# Altium schematic sheet System.SchDoc
size A4; SheetNumber: 3; SheetTotal: 7
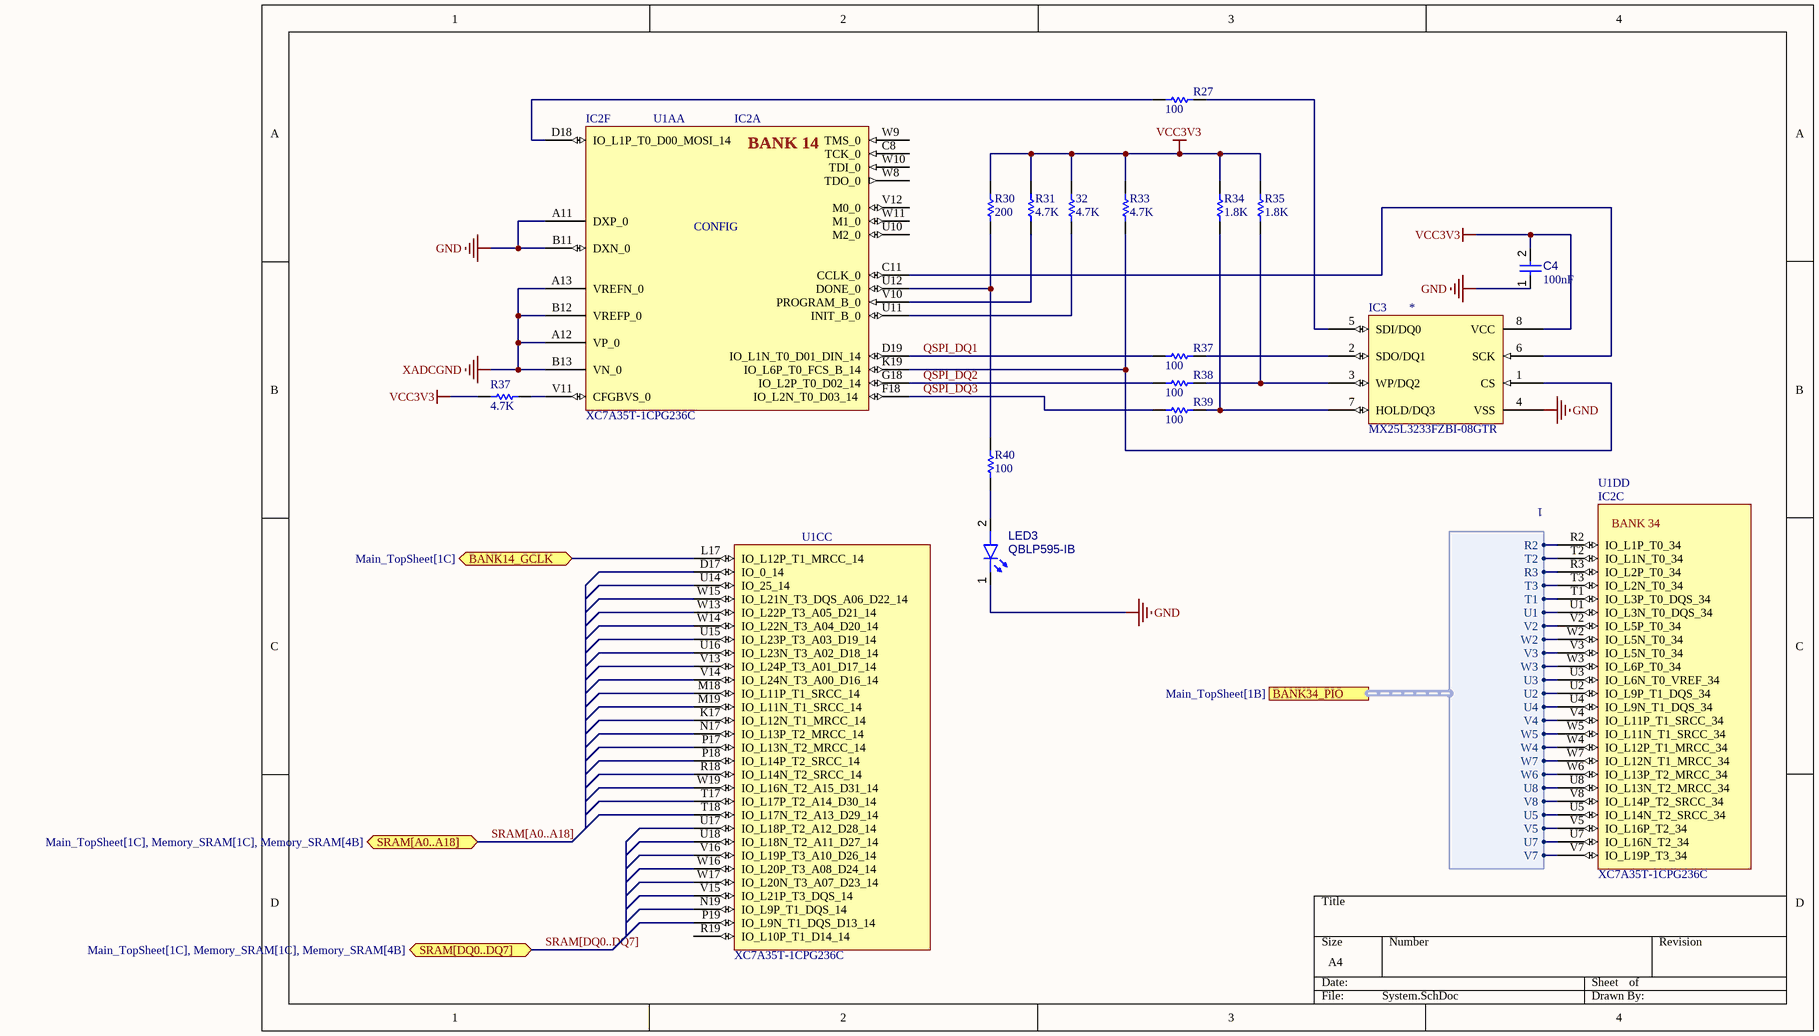
[diagram p0: System.SchDoc]

## Parts
(Parts that share a designator on the sheet are numbered #1, #2 ... from top to bottom, then left to right.)
32  value 4.7K  [RESC1005X40X25ML05T10]  (hidden comment: Resistor 51k +/-5% 0402 63 mW)
*  MX25L3233FZBI-08GTR  [SON127P500X80_HS-9N]
C4  value 100nF  [CAPC0402(1005)60_L]  (hidden comment: Capacitor 100nF +/-20% 10V 0402)
LED3  QBLP595-IB  [QTB-QBLP595_V]
R27  value 100  [RESC1005X40X25ML05T10]  (hidden comment: Resistor 51k +/-5% 0402 63 mW)
R30  value 200  [RESC1005X40X25ML05T10]  (hidden comment: Resistor 51k +/-5% 0402 63 mW)
R31  value 4.7K  [RESC1005X40X25ML05T10]  (hidden comment: Resistor 51k +/-5% 0402 63 mW)
R33  value 4.7K  [RESC1005X40X25ML05T10]  (hidden comment: Resistor 51k +/-5% 0402 63 mW)
R34  value 1.8K  [RESC1005X40X25ML05T10]  (hidden comment: Resistor 51k +/-5% 0402 63 mW)
R35  value 1.8K  [RESC1005X40X25ML05T10]  (hidden comment: Resistor 51k +/-5% 0402 63 mW)
R37#1  value 100  [RESC1005X40X25ML05T10]  (hidden comment: Resistor 51k +/-5% 0402 63 mW)
R37#2  value 4.7K  [RESC1005X40X25ML05T10]  (hidden comment: Resistor 51k +/-5% 0402 63 mW)
R38  value 100  [RESC1005X40X25ML05T10]  (hidden comment: Resistor 51k +/-5% 0402 63 mW)
R39  value 100  [RESC1005X40X25ML05T10]  (hidden comment: Resistor 51k +/-5% 0402 63 mW)
R40  value 100  [RESC1005X40X25ML05T10]  (hidden comment: Resistor 51k +/-5% 0402 63 mW)
U1A  XC7A35T-1CPG236C  [BGA81C50P19X19_1000X1000X110]  (part A of 3)
U1C  XC7A35T-1CPG236C  [BGA81C50P19X19_1000X1000X110]  (part C of 4)
U1D  XC7A35T-1CPG236C  [BGA81C50P19X19_1000X1000X110]  (part D of 4)

## Ports
BANK14_GCLK (bidir, see Main_TopSheet[1C]), BANK34_PIO (harness 1, see Main_TopSheet[1B]), SRAM[A0..A18] (bidir, see Main_TopSheet[1C], Memory_SRAM[1C], Memory_SRAM[4B]), SRAM[DQ0..DQ7] (bidir, see Main_TopSheet[1C], Memory_SRAM[1C], Memory_SRAM[4B])

## Harnesses
1: R2, T2, R3, T3, T1, U1, V2, W2, V3, W3, U3, U2, U4, V4, W5, W4, W7, W6, U8, V8, U5, V5, U7, V7

## Nets
GND: *.4(VSS) C4.1 LED3.1(K) U1A.A11(DXP_0) U1A.B11(DXN_0)
VCC3V3: 32.2 *.8(VCC) C4.2 R30.2 R31.2 R33.2 R34.2 R35.2 R37#2.1
XADCGND: U1A.A12(VP_0) U1A.A13(VREFN_0) U1A.B12(VREFP_0) U1A.B13(VN_0)
BANK14_GCLK: U1C.L17(IO_L12P_T1_MRCC_14) ; port BANK14_GCLK
QSPI_DQ1: R37#1.1 U1A.D19(IO_L1N_T0_D01_DIN_14)
QSPI_DQ2: R38.1 U1A.G18(IO_L2P_T0_D02_14)
QSPI_DQ3: R39.1 U1A.F18(IO_L2N_T0_D03_14)
Net32_1: 32.1 U1A.U11(INIT_B_0)
Net*_1: *.1(CS) R33.1 U1A.K19(IO_L6P_T0_FCS_B_14)
Net*_2: *.2(SDO/DQ1) R37#1.2
Net*_3: *.3(WP/DQ2) R35.1 R38.2
Net*_5: *.5(SDI/DQ0) R27.2
Net*_6: *.6(SCK) U1A.C11(CCLK_0)
Net*_7: *.7(HOLD/DQ3) R34.1 R39.2
NetLED3_2: LED3.2(A) R40.1
NetR27_1: R27.1 U1A.D18(IO_L1P_T0_D00_MOSI_14)
NetR30_1: R30.1 R40.2 U1A.U12(DONE_0)
NetR31_1: R31.1 U1A.V10(PROGRAM_B_0)
NetR37#2_2: R37#2.2 U1A.V11(CFGBVS_0)
NetU1D_R2: U1D.R2(IO_L1P_T0_34) ; port BANK34_PIO.R2
NetU1D_R3: U1D.R3(IO_L2P_T0_34) ; port BANK34_PIO.R3
NetU1D_T1: U1D.T1(IO_L3P_T0_DQS_34) ; port BANK34_PIO.T1
NetU1D_T2: U1D.T2(IO_L1N_T0_34) ; port BANK34_PIO.T2
NetU1D_T3: U1D.T3(IO_L2N_T0_34) ; port BANK34_PIO.T3
NetU1D_U1: U1D.U1(IO_L3N_T0_DQS_34) ; port BANK34_PIO.U1
NetU1D_U2: U1D.U2(IO_L9P_T1_DQS_34) ; port BANK34_PIO.U2
NetU1D_U3: U1D.U3(IO_L6N_T0_VREF_34) ; port BANK34_PIO.U3
NetU1D_U4: U1D.U4(IO_L9N_T1_DQS_34) ; port BANK34_PIO.U4
NetU1D_U5: U1D.U5(IO_L14N_T2_SRCC_34) ; port BANK34_PIO.U5
NetU1D_U7: U1D.U7(IO_L16N_T2_34) ; port BANK34_PIO.U7
NetU1D_U8: U1D.U8(IO_L13N_T2_MRCC_34) ; port BANK34_PIO.U8
NetU1D_V2: U1D.V2(IO_L5P_T0_34) ; port BANK34_PIO.V2
NetU1D_V3: U1D.V3(IO_L5N_T0_34) ; port BANK34_PIO.V3
NetU1D_V4: U1D.V4(IO_L11P_T1_SRCC_34) ; port BANK34_PIO.V4
NetU1D_V5: U1D.V5(IO_L16P_T2_34) ; port BANK34_PIO.V5
NetU1D_V7: U1D.V7(IO_L19P_T3_34) ; port BANK34_PIO.V7
NetU1D_V8: U1D.V8(IO_L14P_T2_SRCC_34) ; port BANK34_PIO.V8
NetU1D_W2: U1D.W2(IO_L5N_T0_34) ; port BANK34_PIO.W2
NetU1D_W3: U1D.W3(IO_L6P_T0_34) ; port BANK34_PIO.W3
NetU1D_W4: U1D.W4(IO_L12P_T1_MRCC_34) ; port BANK34_PIO.W4
NetU1D_W5: U1D.W5(IO_L11N_T1_SRCC_34) ; port BANK34_PIO.W5
NetU1D_W6: U1D.W6(IO_L13P_T2_MRCC_34) ; port BANK34_PIO.W6
NetU1D_W7: U1D.W7(IO_L12N_T1_MRCC_34) ; port BANK34_PIO.W7

Not connected (* = marked no-connect by the designer): U1A C8(TCK_0) U10(M2_0) V12(M0_0) W8(TDO_0) W9(TMS_0) W10(TDI_0) W11(M1_0); U1C D17(IO_0_14) K17(IO_L12N_T1_MRCC_14) M18(IO_L11P_T1_SRCC_14) M19(IO_L11N_T1_SRCC_14) N17(IO_L13P_T2_MRCC_14) N19(IO_L9P_T1_DQS_14) P17(IO_L13N_T2_MRCC_14) P18(IO_L14P_T2_SRCC_14) P19(IO_L9N_T1_DQS_D13_14) R18(IO_L14N_T2_SRCC_14) R19(IO_L10P_T1_D14_14) T17(IO_L17P_T2_A14_D30_14) T18(IO_L17N_T2_A13_D29_14) U14(IO_25_14) U15(IO_L23P_T3_A03_D19_14) U16(IO_L23N_T3_A02_D18_14) U17(IO_L18P_T2_A12_D28_14) U18(IO_L18N_T2_A11_D27_14) V13(IO_L24P_T3_A01_D17_14) V14(IO_L24N_T3_A00_D16_14) V15(IO_L21P_T3_DQS_14) V16(IO_L19P_T3_A10_D26_14) W13(IO_L22P_T3_A05_D21_14) W14(IO_L22N_T3_A04_D20_14) W15(IO_L21N_T3_DQS_A06_D22_14) W16(IO_L20P_T3_A08_D24_14) W17(IO_L20N_T3_A07_D23_14) W19(IO_L16N_T2_A15_D31_14)

## Buses and harness runs
bus SRAM[A0..A18] = port SRAM[A0..A18]
bus SRAM[DQ0..DQ7] = port SRAM[DQ0..DQ7]

## Notes on the sheet
- (in symbol CMP-020-00028-1) IC3
- (in symbol CMP-020-00032-2, part A) IC2F; CONFIG
- (in symbol CMP-020-00032-3, part D) IC2C; BANK 34
- (in symbol CMP-020-00032-4, part C) IC2A; BANK 14

## Library data of the parts
32 R27 R30 R31 R33-R35 R37#1 R37#2 R38-R40 = CMP-009-00000-5: Chip Resistor, 51 KOhm, +/- 5%, 0.063 W, -55 to 155 degC, 0402 (1005 Metric); Power: 63mW; Case/Package: 0402; Min Operating Temperature: -55°C; Mounting Technology: SM; RoHS Compliant: True; Max Operating Temperature: 155°C; Tolerance: 5%; Pins: 2
* = CMP-020-00028-1: NOR Flash Serial-3Wire 3V 32Mbit 32M/16M/8M x 1Bit/2Bit/4Bit 8-Pin USON T/R
C4 = CMP-001-00061-3: Chip Capacitor, 100nF +/-20%, 10V, 0402, Thickness 0.6 mm; Tolerance: 20%; Mounting Technology: SMT; Voltage Rating: 10V; Max Operating Temperature: 85°C; Pins: 2; Case/Package: 0402; Min Operating Temperature: -55°C
LED3 = CMP-007-00042-3: Chip LED 0402, Blue, 0.02 A, 3.1 to 3.7 V, -40 to 80 degC, 2-Pin SMD, RoHS, Tape and Reel; RoHS Compliant: Yes; Colour: Blue; Pins: 2; Case/Package: 0402; Mounting Technology: SMT
U1A = CMP-020-00032-2: FPGA Artix-7 Family 33280 Cells 28nm Technology 1V 236-Pin CSBGA; Min Supply Voltage: 950mV; Max Supply Voltage: 1.05V; Clock Frequency: 1.098GHz; RAM Size: 225kB; Pins: 236; Max Operating Temperature: 85°C; Case/Package: LFBGA; Min Operating Temperature: 0°C
U1C = CMP-020-00032-4: FPGA Artix-7 Family 33280 Cells 28nm Technology 1V 236-Pin CSBGA; Clock Frequency: 1.098GHz; Min Supply Voltage: 950mV; RAM Size: 225kB; Max Supply Voltage: 1.05V; Max Operating Temperature: 85°C; Min Operating Temperature: 0°C; Case/Package: LFBGA; Pins: 236
U1D = CMP-020-00032-3: FPGA Artix-7 Family 33280 Cells 28nm Technology 1V 236-Pin CSBGA; Max Supply Voltage: 1.05V; Min Supply Voltage: 950mV; RAM Size: 225kB; Clock Frequency: 1.098GHz; Min Operating Temperature: 0°C; Case/Package: LFBGA; Pins: 236; Max Operating Temperature: 85°C